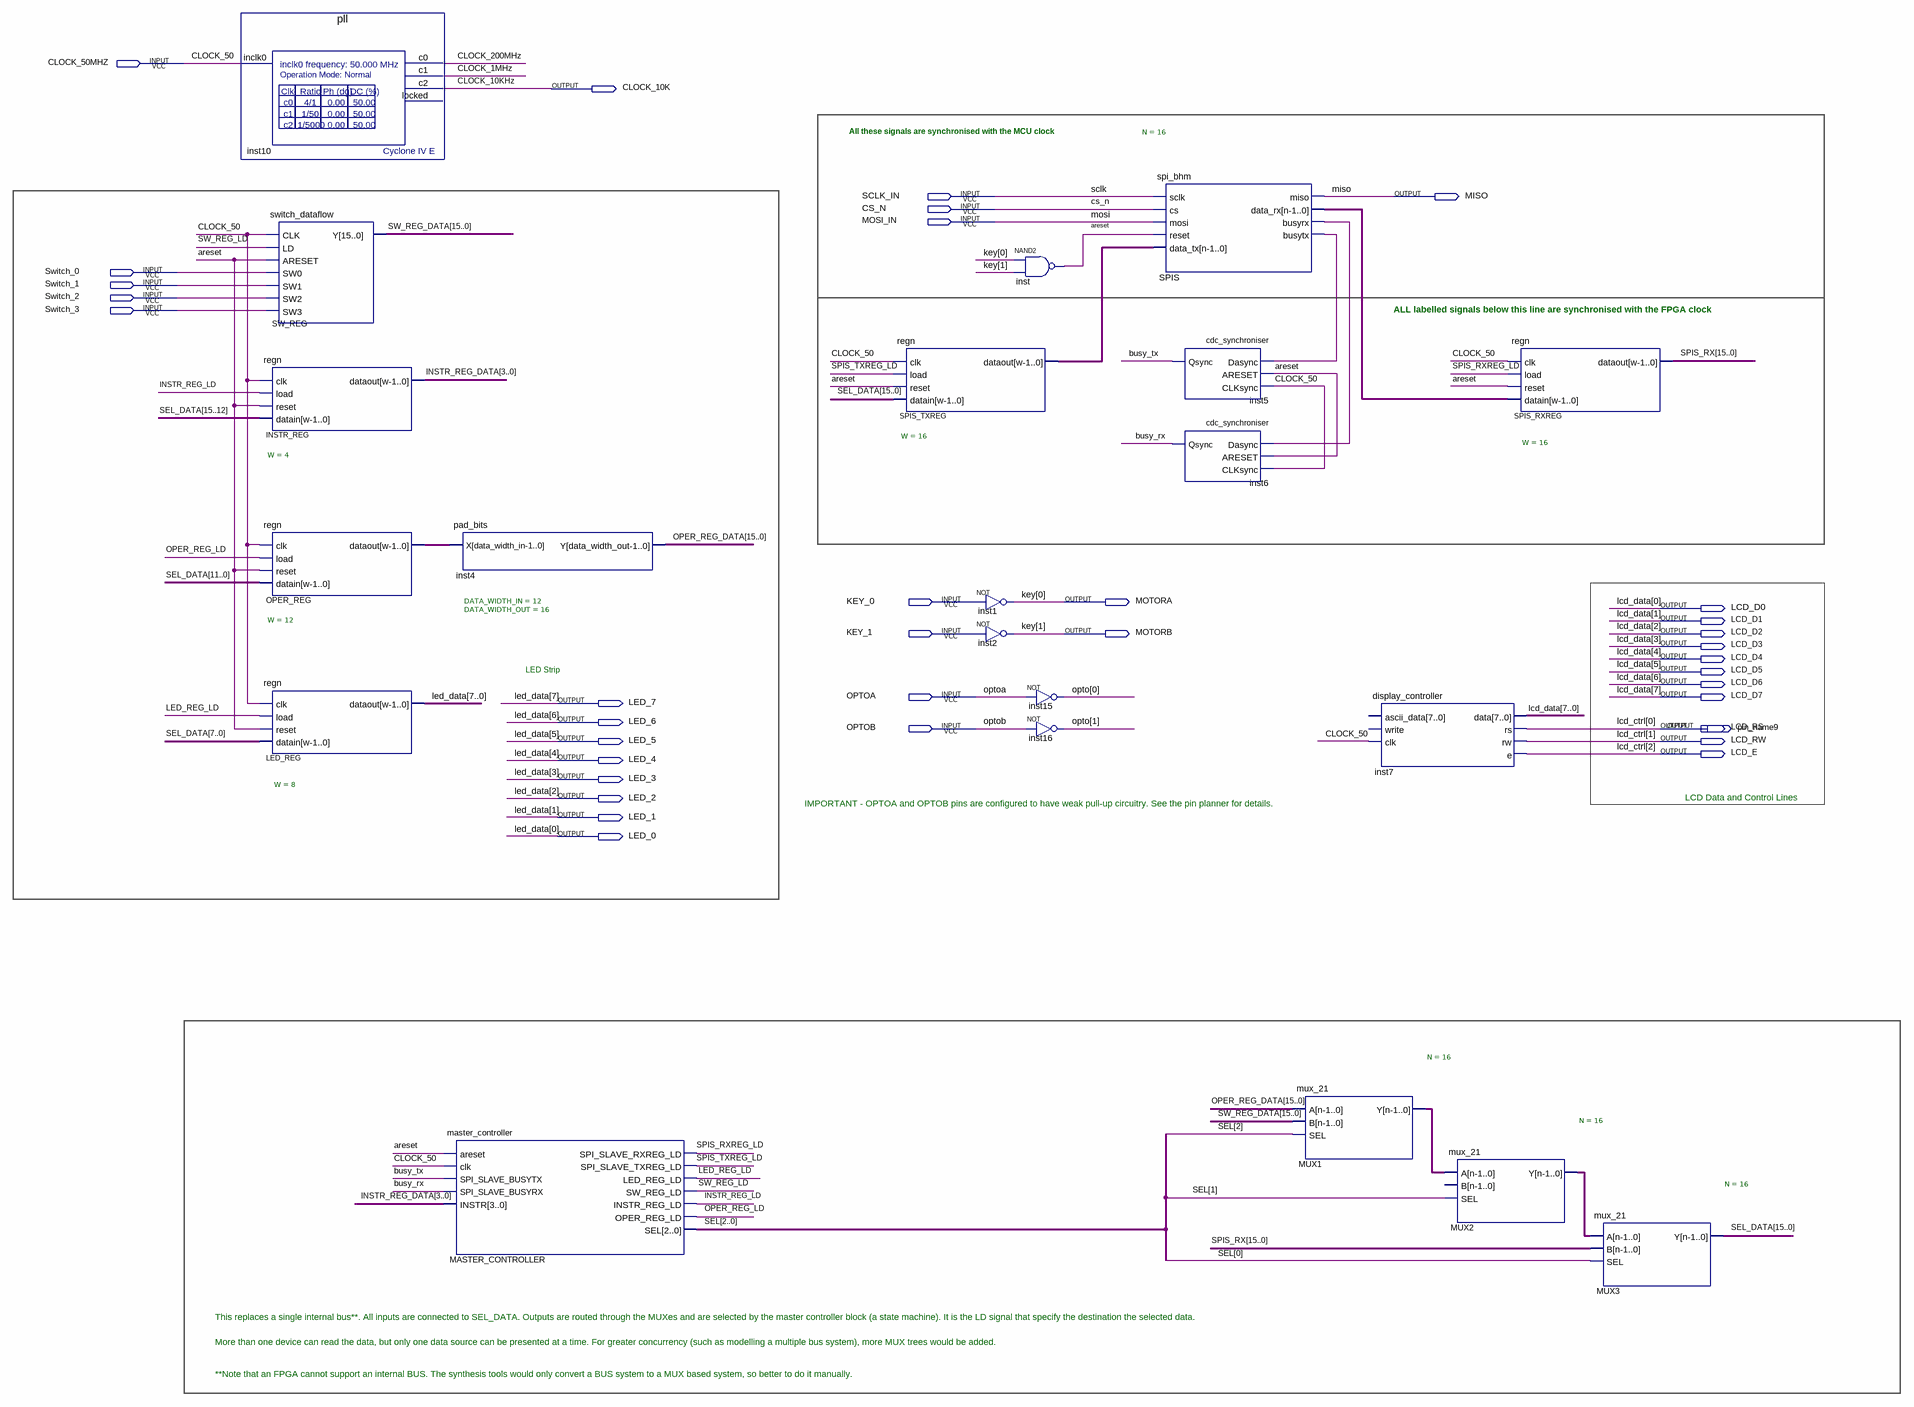
[diagram p0: schematic sheet]
// Quartus schematic spi_test.bdf as structural Verilog: 21 symbols, 36 pins
module spi_test (
  input  CLOCK_50MHZ,
  input  SCLK_IN,
  input  CS_N,
  input  MOSI_IN,
  input  Switch_0,
  input  Switch_1,
  input  Switch_2,
  input  Switch_3,
  input  KEY_0,
  input  KEY_1,
  input  OPTOA,
  input  OPTOB,
  output CLOCK_10K,
  output MISO,
  output MOTORA,
  output LCD_D0,
  output LCD_D1,
  output MOTORB,
  output LCD_D2,
  output LCD_D3,
  output LCD_D4,
  output LCD_D5,
  output LCD_D6,
  output LCD_D7,
  output LED_7,
  output LED_6,
  output LCD_RS,
  output pin_name9,
  output LED_5,
  output LCD_RW,
  output LCD_E,
  output LED_4,
  output LED_3,
  output LED_2,
  output LED_1,
  output LED_0
);

  wire areset, busy_rx, busy_tx, CLOCK_1MHz, CLOCK_200MHz, INSTR_REG_LD, LED_REG_LD, OPER_REG_LD,
       SPIS_busyrx, SPIS_busytx, SPIS_RXREG_LD, SPIS_TXREG_LD, SW_REG_LD;
  wire [1:0] opto;
  wire [2:0] SEL;
  wire [3:0] INSTR_REG_DATA;
  wire [11:0] OPER_REG_dataout;
  wire [15:0] MUX1_y, MUX2_y, OPER_REG_DATA, SEL_DATA, SPIS_data_rx, SPIS_RX, SPIS_TXREG_dataout, SW_REG_DATA;

  pll inst10 (.inclk0(CLOCK_50MHZ), .c0(CLOCK_200MHz), .c1(CLOCK_1MHz), .c2(CLOCK_10K));  // open: locked
  switch_dataflow SW_REG (
    .CLK(CLOCK_50MHZ), .LD(SW_REG_LD), .ARESET(areset), .SW0(Switch_0), .SW1(Switch_1), .SW2(Switch_2),
    .SW3(Switch_3), .Y(SW_REG_DATA));
  regn #(.W(4)) INSTR_REG (
    .clk(CLOCK_50MHZ), .load(INSTR_REG_LD), .reset(areset), .datain(SEL_DATA[15:12]), .dataout(INSTR_REG_DATA));
  regn #(.W(12)) OPER_REG (
    .clk(CLOCK_50MHZ), .load(OPER_REG_LD), .reset(areset), .datain(SEL_DATA[11:0]), .dataout(OPER_REG_dataout));
  regn #(.W(8)) LED_REG (
    .clk(CLOCK_50MHZ), .load(LED_REG_LD), .reset(areset), .datain(SEL_DATA[7:0]),
    .dataout({LED_7, LED_6, LED_5, LED_4, LED_3, LED_2, LED_1, LED_0}));
  pad_bits #(.DATA_WIDTH_IN(12), .DATA_WIDTH_OUT(16)) inst4 (.X(OPER_REG_dataout), .Y(OPER_REG_DATA));
  master_controller MASTER_CONTROLLER (
    .areset(areset), .clk(CLOCK_50MHZ), .SPI_SLAVE_BUSYTX(busy_tx), .SPI_SLAVE_BUSYRX(busy_rx),
    .INSTR(INSTR_REG_DATA), .SPI_SLAVE_RXREG_LD(SPIS_RXREG_LD), .SPI_SLAVE_TXREG_LD(SPIS_TXREG_LD),
    .LED_REG_LD(LED_REG_LD), .SW_REG_LD(SW_REG_LD), .INSTR_REG_LD(INSTR_REG_LD), .OPER_REG_LD(OPER_REG_LD),
    .SEL(SEL));
  regn #(.W(16)) SPIS_TXREG (
    .clk(CLOCK_50MHZ), .load(SPIS_TXREG_LD), .reset(areset), .datain(SEL_DATA), .dataout(SPIS_TXREG_dataout));
  not inst1 (MOTORA, KEY_0);
  not inst2 (MOTORB, KEY_1);
  nand inst (areset, MOTORA, MOTORB);
  not inst15 (opto[0], OPTOA);
  not inst16 (opto[1], OPTOB);
  spi_bhm #(.N(16)) SPIS (
    .sclk(SCLK_IN), .cs(CS_N), .mosi(MOSI_IN), .reset(areset), .data_tx(SPIS_TXREG_dataout), .miso(MISO),
    .data_rx(SPIS_data_rx), .busyrx(SPIS_busyrx), .busytx(SPIS_busytx));
  cdc_synchroniser inst5 (.Dasync(SPIS_busytx), .ARESET(areset), .CLKsync(CLOCK_50MHZ), .Qsync(busy_tx));
  cdc_synchroniser inst6 (.Dasync(SPIS_busyrx), .ARESET(areset), .CLKsync(CLOCK_50MHZ), .Qsync(busy_rx));
  mux_21 #(.N(16)) MUX1 (.A(OPER_REG_DATA), .B(SW_REG_DATA), .SEL(SEL[2]), .Y(MUX1_y));
  display_controller inst7 (
    .clk(CLOCK_50MHZ), .data({LCD_D7, LCD_D6, LCD_D5, LCD_D4, LCD_D3, LCD_D2, LCD_D1, LCD_D0}), .rs(LCD_RS),
    .rw(LCD_RW), .e(LCD_E));  // open: ascii_data, write
  mux_21 #(.N(16)) MUX2 (.A(MUX1_y), .SEL(SEL[1]), .Y(MUX2_y));  // open: B
  regn #(.W(16)) SPIS_RXREG (
    .clk(CLOCK_50MHZ), .load(SPIS_RXREG_LD), .reset(areset), .datain(SPIS_data_rx), .dataout(SPIS_RX));
  mux_21 #(.N(16)) MUX3 (.A(MUX2_y), .B(SPIS_RX), .SEL(SEL[0]), .Y(SEL_DATA));

  // Other names for the same wires on the sheet: CLOCK_10KHz = CLOCK_10K; CLOCK_50 = CLOCK_50MHZ;
  //   key[1:0] = {MOTORB, MOTORA}; lcd_ctrl[2:0] = {LCD_E, LCD_RW, LCD_RS};
  //   lcd_data[7:0] = {LCD_D7, LCD_D6, LCD_D5, LCD_D4, LCD_D3, LCD_D2, LCD_D1, LCD_D0};
  //   led_data[7:0] = {LED_7, LED_6, LED_5, LED_4, LED_3, LED_2, LED_1, LED_0}; mosi = MOSI_IN; sclk = SCLK_IN

  // Notes on the sheet:
  //   All these signals are synchronised with the MCU clock
  //   ALL labelled signals below this line are synchronised with the FPGA clock
  //   LED Strip
  //   LCD Data and Control Lines
  //   IMPORTANT - OPTOA and OPTOB pins are configured to have weak pull-up circuitry. See the pin planner for details.
  //   This replaces a single internal bus**. All inputs are connected to SEL_DATA. Outputs are routed through the MUXes and are selected by the master controller block (a state machine). It is the LD signal that specify the destination the selected data. 
  //   More than one device can read the data, but only one data source can be presented at a time. For greater concurrency (such as modelling a multiple bus system), more MUX trees would be added.
  //   **Note that an FPGA cannot support an internal BUS. The synthesis tools would only convert a BUS system to a MUX based system, so better to do it manually.
endmodule
